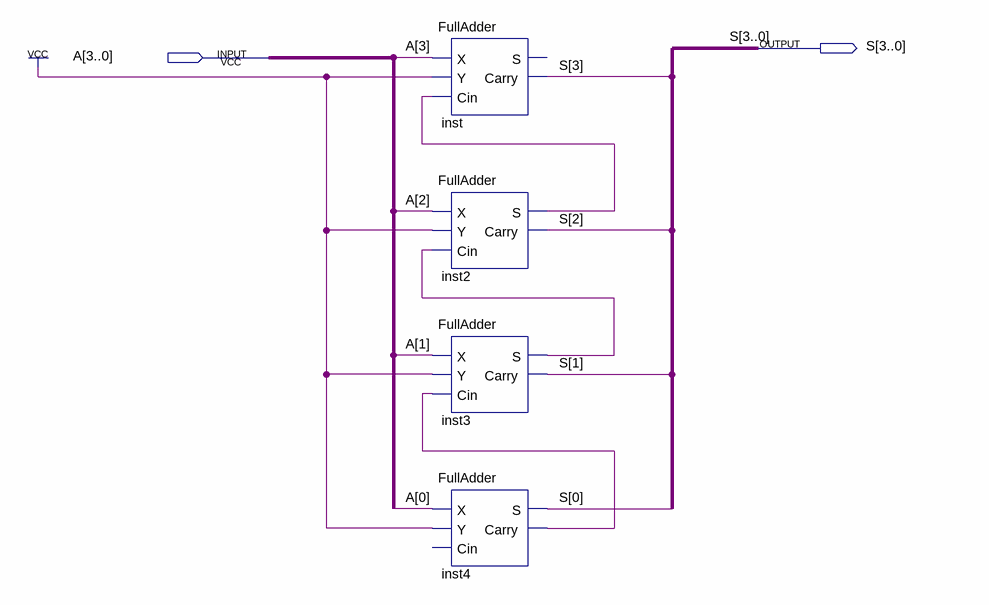
[diagram p0: schematic sheet]
// Quartus schematic TRUDI1.bdf as structural Verilog: 4 symbols, 2 pins
module TRUDI1 (
  input  [3:0] A,
  output [3:0] S
);

  wire inst2_s, inst3_s, inst4_carry;

  FullAdder inst (.X(A[3]), .Y(1'b1), .Cin(inst2_s), .Carry(S[3]));  // open: S
  FullAdder inst2 (.X(A[2]), .Y(1'b1), .Cin(inst3_s), .S(inst2_s), .Carry(S[2]));
  FullAdder inst3 (.X(A[1]), .Y(1'b1), .Cin(inst4_carry), .S(inst3_s), .Carry(S[1]));
  FullAdder inst4 (.X(A[0]), .Y(1'b1), .S(S[0]), .Carry(inst4_carry));  // open: Cin
endmodule
